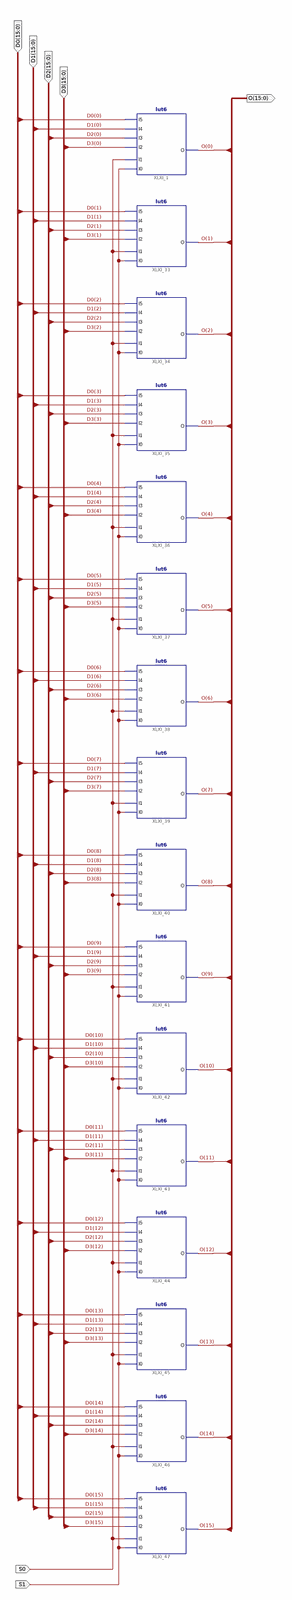
[diagram p0: schematic sheet 1, whole]
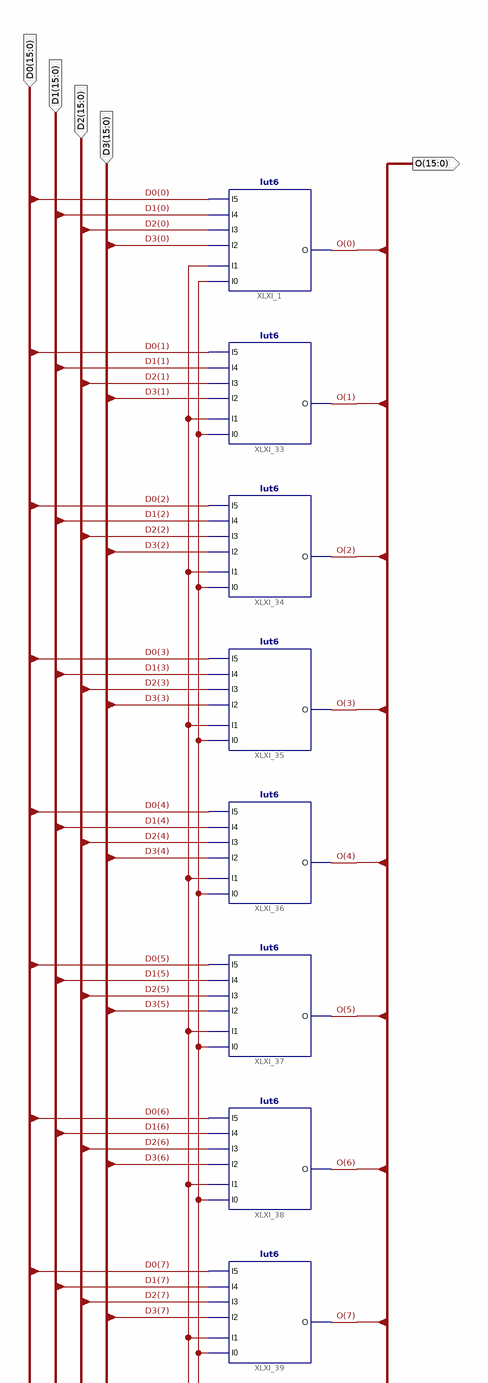
[diagram p1: schematic sheet 1, upper part]
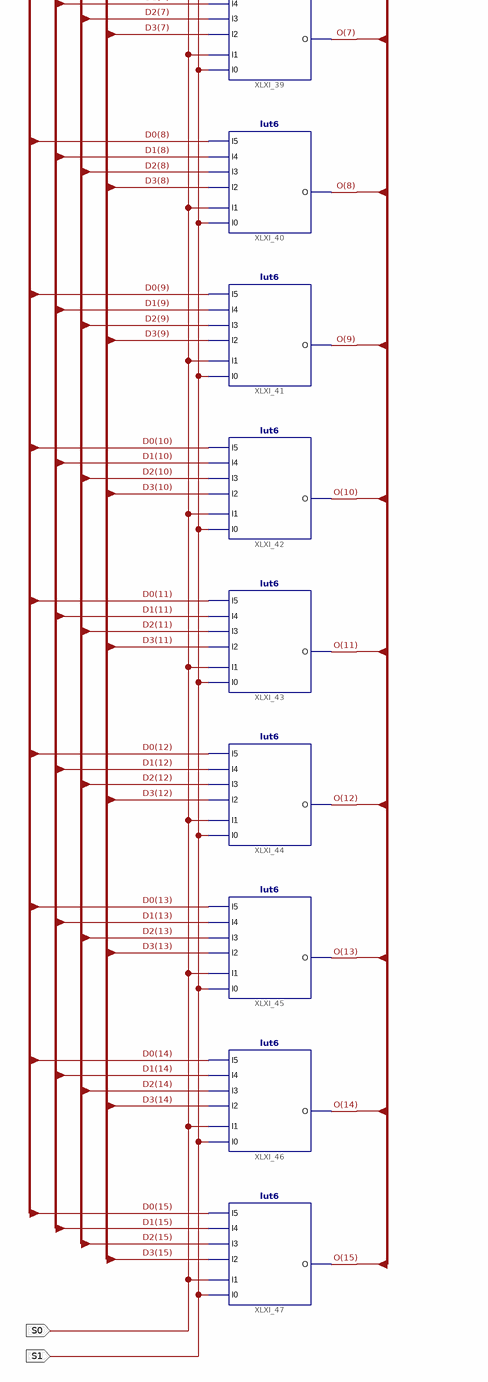
[diagram p2: schematic sheet 1, lower part]
// Xilinx ISE schematic mux4x1x16t.sch (spartan6) as structural Verilog: 16 symbols, 7 ports
module mux4x1x16t (
  input  [15:0] D0,
  input  [15:0] D1,
  input  [15:0] D2,
  input  [15:0] D3,
  input  S1,
  input  S0,
  output [15:0] O
);

  lut6 #(.INIT("F7D5B391E6C4A280")) XLXI_1 (.O(O[0]), .I0(S1), .I1(S0), .I2(D3[0]), .I3(D2[0]), .I5(D0[0]), .I4(D1[0]));
  lut6 #(.INIT("F7D5B391E6C4A280")) XLXI_33 (
    .O(O[1]), .I0(S1), .I1(S0), .I2(D3[1]), .I3(D2[1]), .I5(D0[1]), .I4(D1[1]));
  lut6 #(.INIT("F7D5B391E6C4A280")) XLXI_34 (
    .O(O[2]), .I0(S1), .I1(S0), .I2(D3[2]), .I3(D2[2]), .I5(D0[2]), .I4(D1[2]));
  lut6 #(.INIT("F7D5B391E6C4A280")) XLXI_35 (
    .O(O[3]), .I0(S1), .I1(S0), .I2(D3[3]), .I3(D2[3]), .I5(D0[3]), .I4(D1[3]));
  lut6 #(.INIT("F7D5B391E6C4A280")) XLXI_36 (
    .O(O[4]), .I0(S1), .I1(S0), .I2(D3[4]), .I3(D2[4]), .I5(D0[4]), .I4(D1[4]));
  lut6 #(.INIT("F7D5B391E6C4A280")) XLXI_37 (
    .O(O[5]), .I0(S1), .I1(S0), .I2(D3[5]), .I3(D2[5]), .I5(D0[5]), .I4(D1[5]));
  lut6 #(.INIT("F7D5B391E6C4A280")) XLXI_38 (
    .O(O[6]), .I0(S1), .I1(S0), .I2(D3[6]), .I3(D2[6]), .I5(D0[6]), .I4(D1[6]));
  lut6 #(.INIT("F7D5B391E6C4A280")) XLXI_39 (
    .O(O[7]), .I0(S1), .I1(S0), .I2(D3[7]), .I3(D2[7]), .I5(D0[7]), .I4(D1[7]));
  lut6 #(.INIT("F7D5B391E6C4A280")) XLXI_40 (
    .O(O[8]), .I0(S1), .I1(S0), .I2(D3[8]), .I3(D2[8]), .I5(D0[8]), .I4(D1[8]));
  lut6 #(.INIT("F7D5B391E6C4A280")) XLXI_41 (
    .O(O[9]), .I0(S1), .I1(S0), .I2(D3[9]), .I3(D2[9]), .I5(D0[9]), .I4(D1[9]));
  lut6 #(.INIT("F7D5B391E6C4A280")) XLXI_42 (
    .O(O[10]), .I0(S1), .I1(S0), .I2(D3[10]), .I3(D2[10]), .I5(D0[10]), .I4(D1[10]));
  lut6 #(.INIT("F7D5B391E6C4A280")) XLXI_43 (
    .O(O[11]), .I0(S1), .I1(S0), .I2(D3[11]), .I3(D2[11]), .I5(D0[11]), .I4(D1[11]));
  lut6 #(.INIT("F7D5B391E6C4A280")) XLXI_44 (
    .O(O[12]), .I0(S1), .I1(S0), .I2(D3[12]), .I3(D2[12]), .I5(D0[12]), .I4(D1[12]));
  lut6 #(.INIT("F7D5B391E6C4A280")) XLXI_45 (
    .O(O[13]), .I0(S1), .I1(S0), .I2(D3[13]), .I3(D2[13]), .I5(D0[13]), .I4(D1[13]));
  lut6 #(.INIT("F7D5B391E6C4A280")) XLXI_46 (
    .O(O[14]), .I0(S1), .I1(S0), .I2(D3[14]), .I3(D2[14]), .I5(D0[14]), .I4(D1[14]));
  lut6 #(.INIT("F7D5B391E6C4A280")) XLXI_47 (
    .O(O[15]), .I0(S1), .I1(S0), .I2(D3[15]), .I3(D2[15]), .I5(D0[15]), .I4(D1[15]));
endmodule
